# EAGLE design harp camera controller breakout v1.0 (EAGLE 9.5.1)
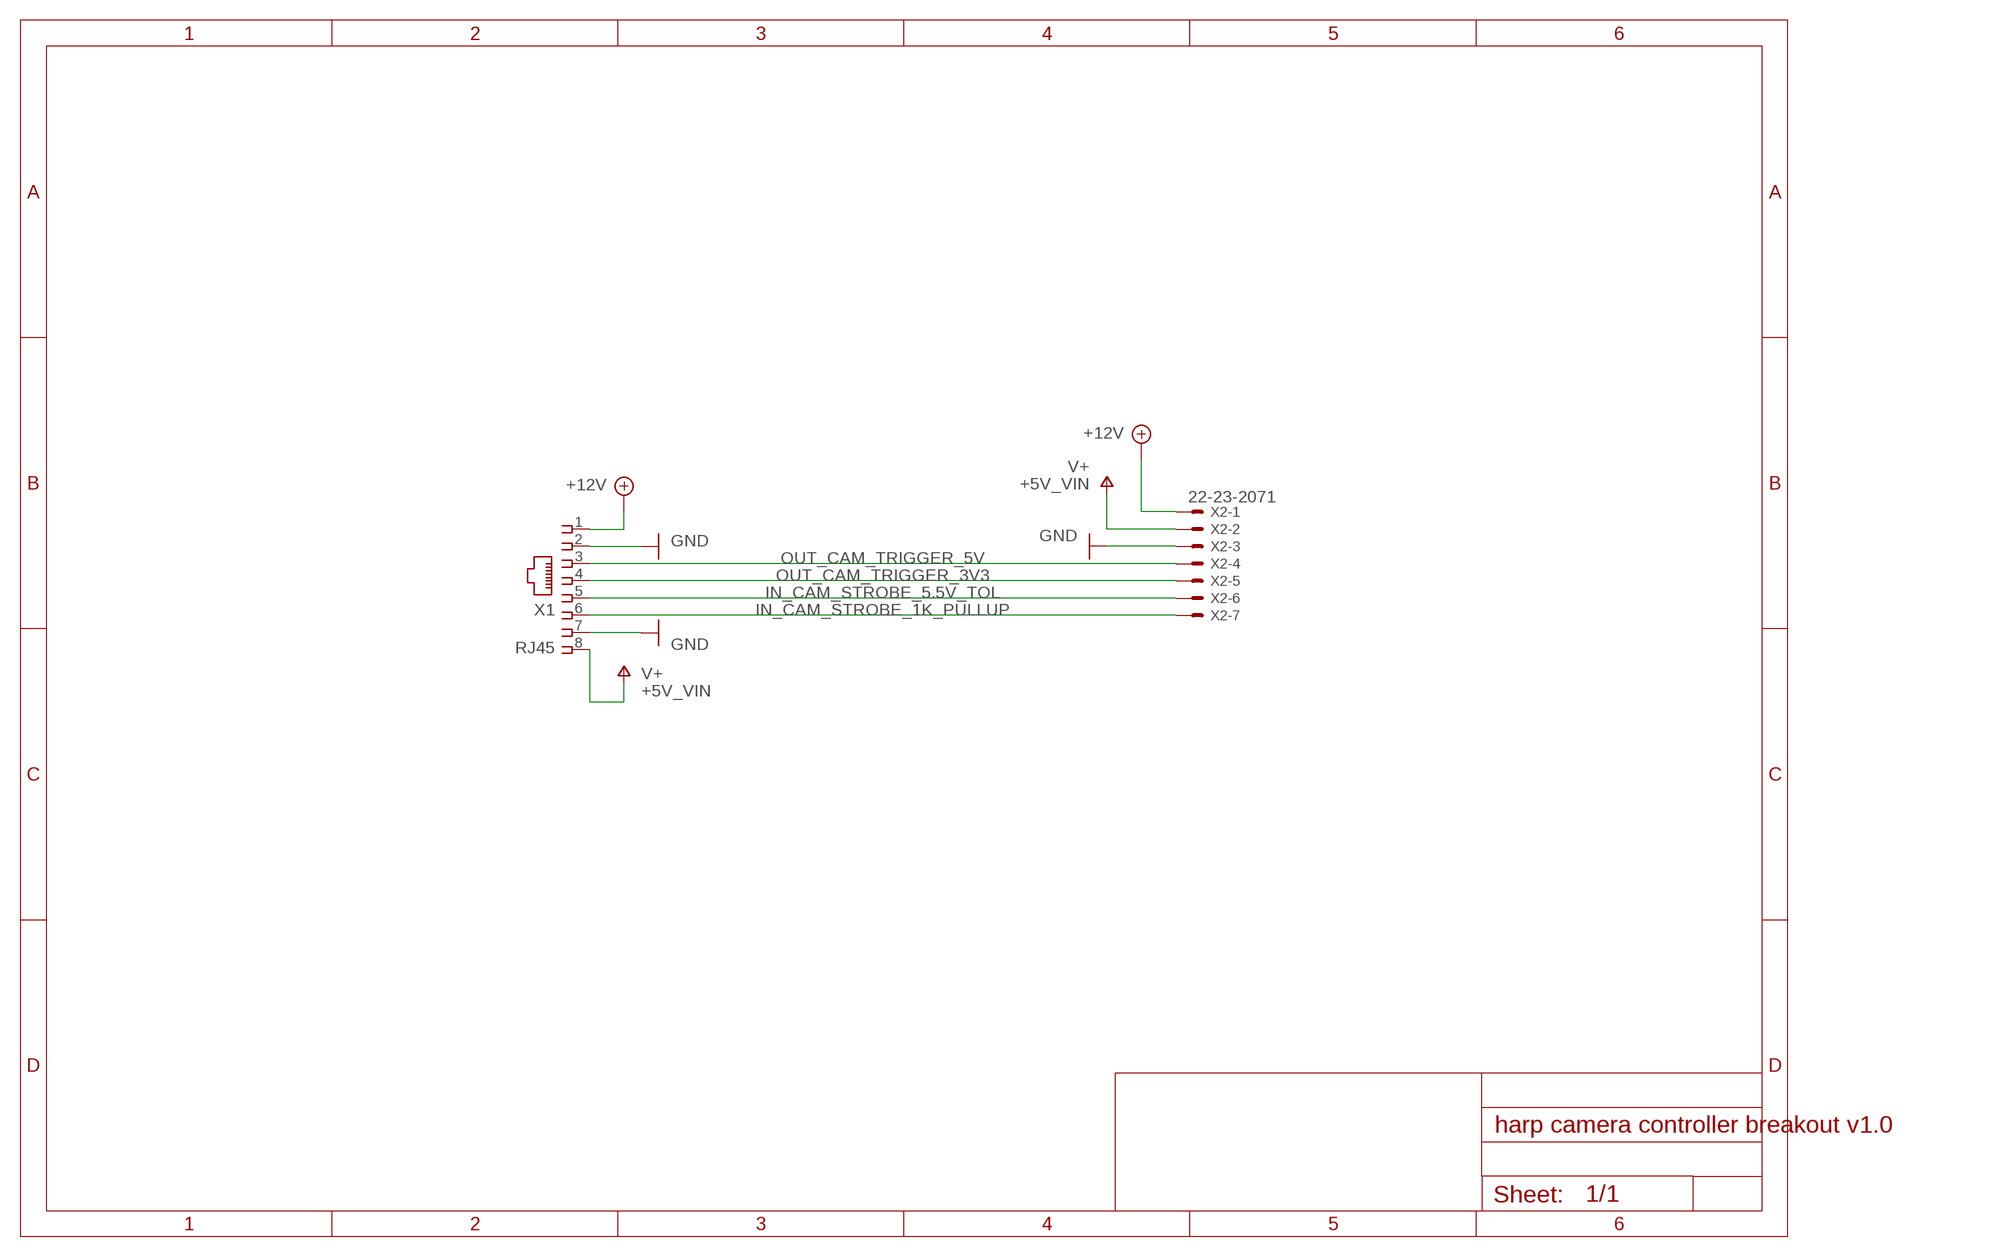
[diagram p0: schematic, sheet 1]

## Parts
X1  RJ45  [RJ45-NO-SHIELD]
X2  22-23-2071  [22-23-2071]

## Nets
+5V_VIN: X1.8 X2.2 ; supply symbol labelled V+
+12V: X1.1 X2.1
GND: X1.2 X1.7 X2.3
IN_CAM_STROBE_1K_PULLUP: X1.6 X2.7
IN_CAM_STROBE_5.5V_TOL: X1.5 X2.6
OUT_CAM_TRIGGER_3V3: X1.4 X2.5
OUT_CAM_TRIGGER_5V: X1.3 X2.4

## Library data of the parts
X1 = harp camera controller:RJ45: RJ45 8pin; DIGIKEY_PN: A105009CT-ND; MOUSER_PN: 571-2158771; MPN: 215877-1; NOTES: -; TYPE: TH
X2 = con-molex:22-23-2071: .100" (2.54mm) Center Header - 7 Pin; MF: MOLEX; MPN: 22-23-2071; OC_FARNELL: 1654534; OC_NEWARK: 56H0445

## Net classes
1 power: width 0.381 mm

## Board
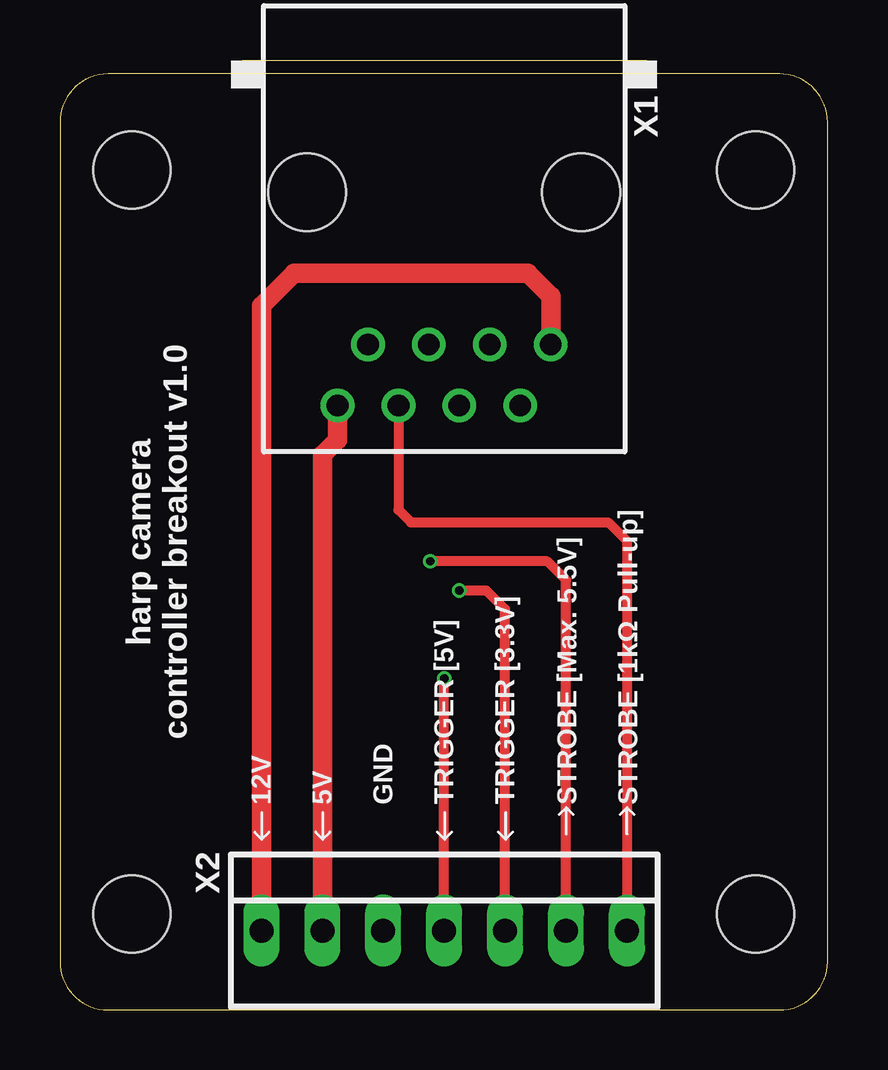
[diagram p1: board, top side]
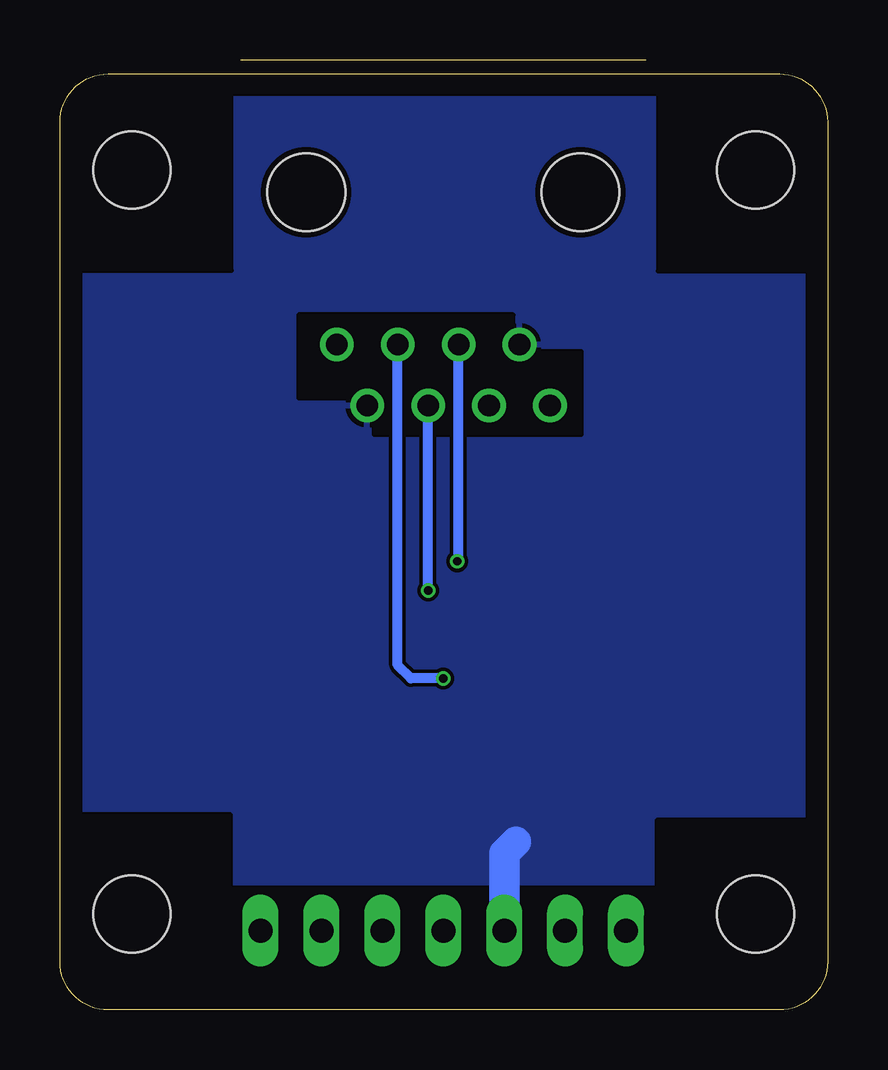
[diagram p2: board, bottom side, seen from below]

Size 32 x 39 mm. Coordinates in mm from the lower left corner, seen from the top.
Outline: 2,0 30,0 arc90 32,2 32,37 arc90 30,39 2,39 arc90 0,37 0,2 arc90 2,0
Copper layers (1*16): Top 0.018mm / dielectric 1.55mm / Bottom 0.018mm
Design rules "eC_2Layer_PClass6_BaseCopperO18_eCDefault *": minimum track width 0.15mm, minimum drill 0.35mm, track to track 0.15mm, track to pad 0.15mm, pad to pad 0.15mm, via to via 0.15mm, smd to smd 0mil, copper to edge 0.25mm, drill to drill 0.35mm, minimum pad ring 0.175mm, minimum via ring 0.125mm, stop-mask expansion 0mil, vias tented up to drill 0.45mm, thermal gap 0.2mm
Holes 3.2 mm at 3,4 29,4 3,35 29,35

### Footprints (pad centres in the part's own frame; a part is rotated, then mirrored left to right if it is on the bottom)
RJ45-NO-SHIELD = drill 0.9 pad 1.4: 1 -4.445,6.35; 2 -3.175,8.89; 3 -1.905,6.35; 4 -0.635,8.89; 5 0.635,6.35; 6 1.905,8.89; 7 3.175,6.35; 8 4.445,8.89 | hole 3.251: -5.715,0; 5.715,0
22-23-2071 = drill 1 long: 1 -7.62,0; 2 -5.08,0; 3 -2.54,0; 4 0,0; 5 2.54,0; 6 5.08,0; 7 7.62,0

### Placement (x,y rotation side)
X1  16.02,34.07 180 top
X2  16.02,3.3 0 top

### Tracks (layer width: path | path; a pad name or v marks a point on that pad's centre or on a via)
+5V_VIN
  Top 0.813: X2.2 10.94,23.13 11.57,23.77 X1.8
+12V
  Top 0.813: X2.1 8.4,29.34 9.75,30.7 19.51,30.7 20.46,29.74 X1.1
GND
  Bottom 1.27: X2.3 13.48,6.52 13,7
  pour Bottom: 1,38 1,0 31,0 31,38
IN_CAM_STROBE_1K_PULLUP
  Top 0.406: X1.6 14.11,20.84 14.63,20.32 22.86,20.32 23.64,19.54 X2.7
IN_CAM_STROBE_5.5V_TOL  (via drill 0.35)
  Top 0.406: X2.6 21.1,17.92 20.32,18.69 v15.44,18.69
  Bottom 0.305: v15.44,18.69 15.38,18.75
  Bottom 0.406: 15.38,18.75 X1.5
N$1
  cutout Bottom: 10.26,27.43 18.9,27.43 18.9,23.98 10.26,23.98
  cutout Bottom: 13.11,28.96 22.05,28.96 22.05,25.5 13.11,25.5
  cutout Bottom: 7.11,5.08 13,5.08 13,1.63 7.11,1.63
  cutout Bottom: 14.02,5.08 24.89,5.08 24.89,1.63 14.02,1.63
  cutout Bottom: 24.89,8.13 31.9,8.13 31.9,0.1 24.89,0.1
  cutout Bottom: 7.11,-0.13 0.1,-0.13 0.1,7.9 7.11,7.9
  cutout Bottom: 24.86,38.84 31.87,38.84 31.87,30.81 24.86,30.81
  cutout Bottom: 0.05,38.83 7.06,38.83 7.06,30.8 0.05,30.8
  cutout Bottom: 12.33,2.08 13.89,2.08 13.89,0.63 12.33,0.63
OUT_CAM_TRIGGER_3V3  (via drill 0.35)
  Top 0.406: X2.5 18.56,16.7 17.78,17.48 v16.65,17.48
  Bottom 0.406: v16.65,17.48 X1.4
OUT_CAM_TRIGGER_5V  (via drill 0.35)
  Top 0.406: X2.4 v16.02,13.82
  Bottom 0.406: v16.02,13.82 17.37,13.82 17.92,14.37 X1.3

### Text on the board
tPlace: harp camera / controller breakout v1.0 | 12V | 5V | GND | TRIGGER [5V] | TRIGGER [3.3V] | STROBE [Max. 5.5V] | STROBE [1kΩ Pull-up]